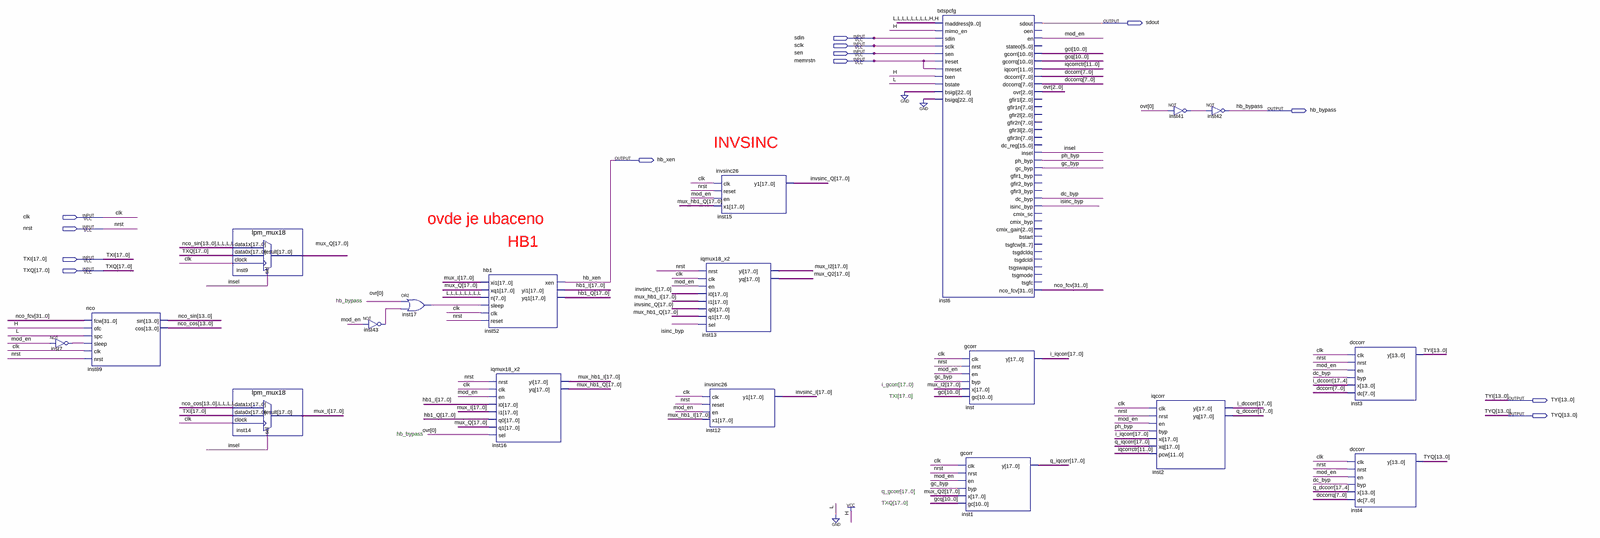
[diagram p0: schematic sheet, whole]
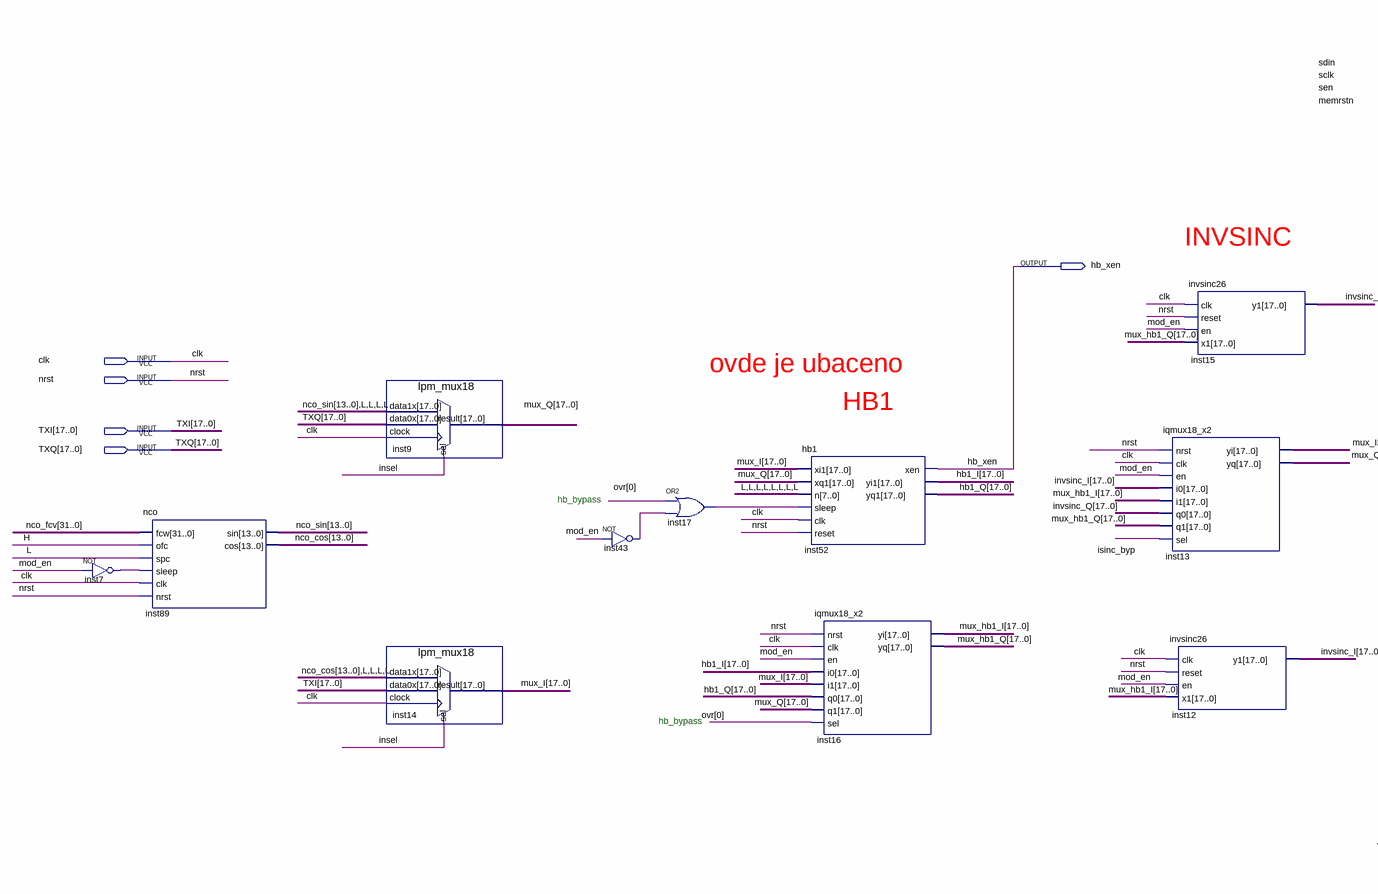
[diagram p1: schematic sheet, left part]
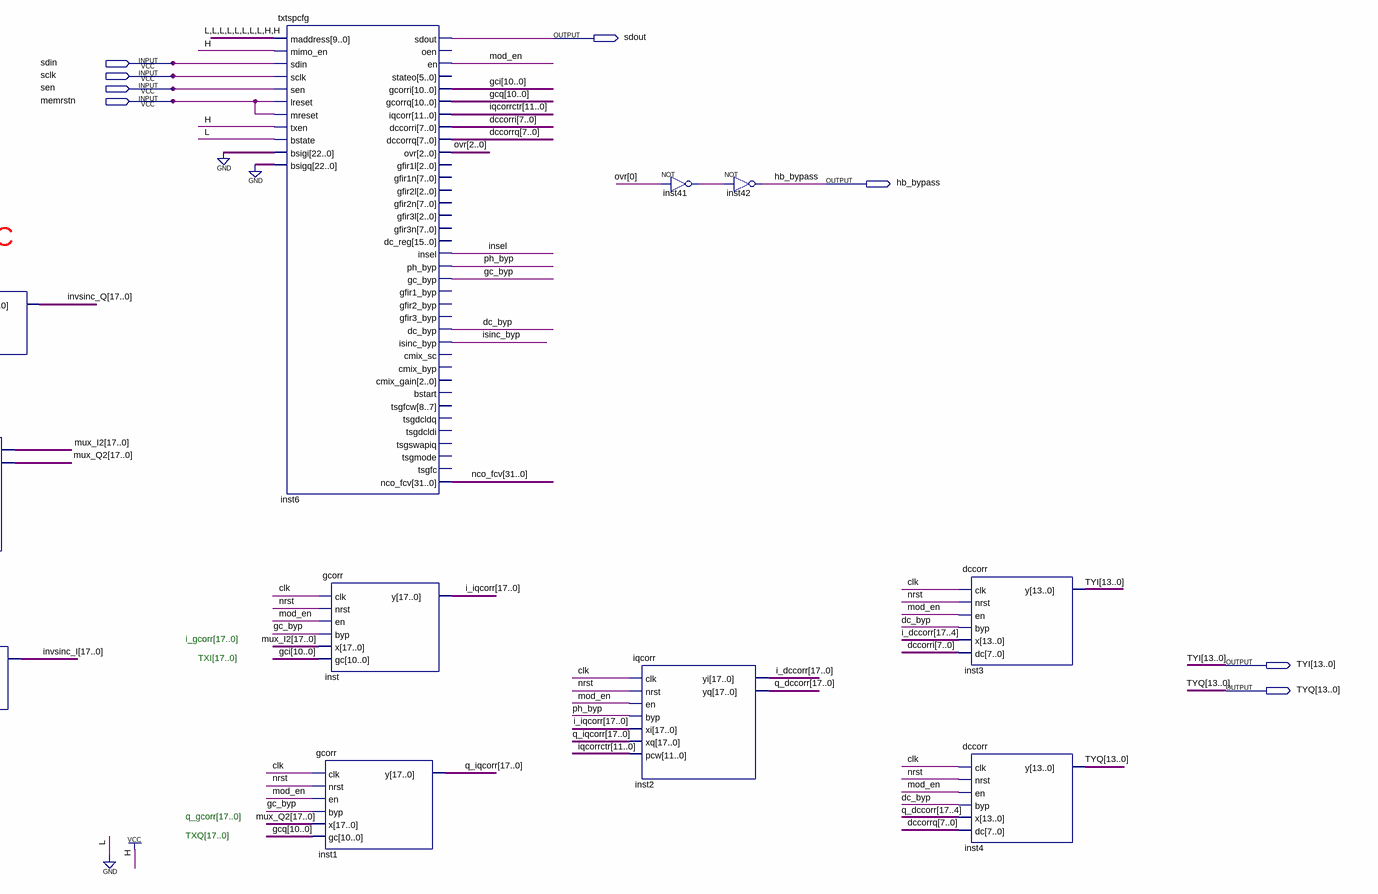
[diagram p2: schematic sheet, right part]
// Quartus schematic tx_chain.bdf as structural Verilog: 19 symbols, 13 pins
module tx_chain (
  input  sdin,
  input  sclk,
  input  sen,
  input  memrstn,
  input  clk,
  input  nrst,
  input  [17:0] TXI,
  input  [17:0] TXQ,
  output sdout,
  output hb_bypass,
  output hb_xen,
  output [13:0] TYI,
  output [13:0] TYQ
);

  wire dc_byp, gc_byp, insel, inst7_out, inst17_out, inst41_out, inst43_out, isinc_byp, mod_en, ph_byp;
  wire [2:0] ovr;
  wire [7:0] dccorri, dccorrq;
  wire [10:0] gci, gcq;
  wire [11:0] iqcorrctr;
  wire [13:0] nco_cos, nco_sin;
  wire [17:0] hb1_I, hb1_Q, i_dccorr, i_iqcorr, invsinc_I, invsinc_Q, mux_hb1_I, mux_hb1_Q, mux_I, mux_I2,
       mux_Q, mux_Q2, q_dccorr, q_iqcorr;
  wire [31:0] nco_fcv;

  not inst7 (inst7_out, mod_en);
  nco inst89 (
    .fcw(nco_fcv), .ofc(1'b1), .spc(1'b0), .sleep(inst7_out), .clk(clk), .nrst(nrst), .sin(nco_sin),
    .cos(nco_cos));
  lpm_mux18 inst9 (.data1x({nco_sin, 4'b0000}), .data0x(TXQ), .clock(clk), .sel(insel), .result(mux_Q));
  lpm_mux18 inst14 (.data1x({nco_cos, 4'b0000}), .data0x(TXI), .clock(clk), .sel(insel), .result(mux_I));
  not inst43 (inst43_out, mod_en);
  or inst17 (inst17_out, ovr[0], inst43_out);
  hb1 inst52 (
    .xi1(mux_I), .xq1(mux_Q), .n({8{1'b0}}), .sleep(inst17_out), .clk(clk), .reset(nrst), .xen(hb_xen),
    .yi1(hb1_I), .yq1(hb1_Q));
  iqmux18_x2 inst16 (
    .nrst(nrst), .clk(clk), .en(mod_en), .i0(hb1_I), .i1(mux_I), .q0(hb1_Q), .q1(mux_Q), .sel(ovr[0]),
    .yi(mux_hb1_I), .yq(mux_hb1_Q));
  invsinc26 inst15 (.clk(clk), .reset(nrst), .en(mod_en), .x1(mux_hb1_Q), .y1(invsinc_Q));
  iqmux18_x2 inst13 (
    .nrst(nrst), .clk(clk), .en(mod_en), .i0(invsinc_I), .i1(mux_hb1_I), .q0(invsinc_Q), .q1(mux_hb1_Q),
    .sel(isinc_byp), .yi(mux_I2), .yq(mux_Q2));
  invsinc26 inst12 (.clk(clk), .reset(nrst), .en(mod_en), .x1(mux_hb1_I), .y1(invsinc_I));
  txtspcfg inst6 (
    .maddress(10'b0000000011), .mimo_en(1'b1), .sdin(sdin), .sclk(sclk), .sen(sen), .lreset(memrstn),
    .mreset(memrstn), .txen(1'b1), .bstate(1'b0), .bsigi({23{1'b0}}), .bsigq({23{1'b0}}), .sdout(sdout),
    .en(mod_en), .gcorri(gci), .gcorrq(gcq), .iqcorr(iqcorrctr), .dccorri(dccorri), .dccorrq(dccorrq),
    .ovr(ovr), .insel(insel), .ph_byp(ph_byp), .gc_byp(gc_byp), .dc_byp(dc_byp), .isinc_byp(isinc_byp),
    .nco_fcv(nco_fcv));  // open: oen, stateo, gfir1l, gfir1n, gfir2l, gfir2n, gfir3l, gfir3n, dc_reg, gfir1_byp, gfir2_byp, gfir3_byp, cmix_sc, cmix_byp, cmix_gain, bstart, tsgfcw, tsgdcldq, tsgdcldi, tsgswapiq, tsgmode, tsgfc
  gcorr inst1 (.clk(clk), .nrst(nrst), .en(mod_en), .byp(gc_byp), .x(mux_Q2), .gc(gcq), .y(q_iqcorr));
  gcorr inst (.clk(clk), .nrst(nrst), .en(mod_en), .byp(gc_byp), .x(mux_I2), .gc(gci), .y(i_iqcorr));
  not inst41 (inst41_out, ovr[0]);
  iqcorr inst2 (
    .clk(clk), .nrst(nrst), .en(mod_en), .byp(ph_byp), .xi(i_iqcorr), .xq(q_iqcorr), .pcw(iqcorrctr),
    .yi(i_dccorr), .yq(q_dccorr));
  not inst42 (hb_bypass, inst41_out);
  dccorr inst3 (.clk(clk), .nrst(nrst), .en(mod_en), .byp(dc_byp), .x(i_dccorr[17:4]), .dc(dccorri), .y(TYI));
  dccorr inst4 (.clk(clk), .nrst(nrst), .en(mod_en), .byp(dc_byp), .x(q_dccorr[17:4]), .dc(dccorrq), .y(TYQ));

  // Notes on the sheet:
  //   INVSINC
  //   ovde je ubaceno
  //   HB1
  //   hb_bypass
  //   i_gcorr[17..0]
  //   TXI[17..0]
  //   hb_bypass
  //   q_gcorr[17..0]
  //   TXQ[17..0]
endmodule
